# Altium schematic sheet CH340C UART USB.SchDoc
size A; SheetNumber: 6; SheetTotal: 6
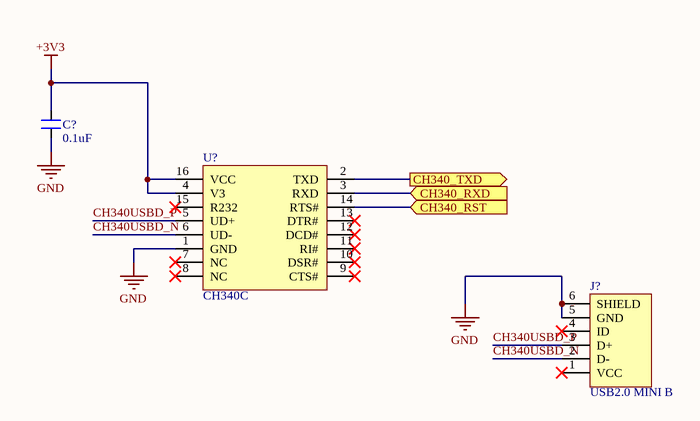
[diagram p0: CH340C UART USB.SchDoc]

## Parts
C?  0.1uF  [CAP_0805]
J?  USB2.0 MINI B  [CON_690-005-299-043]
U?  CH340C  [SOIC16_50_284_25X90_SMT]

## Ports
CH340_RST (in), CH340_RXD (in), CH340_TXD (out)

## Nets
+3V3: C?.1 U?.4(V3) U?.16(VCC)
GND: C?.2 J?.5(GND) J?.6(SHIELD) U?.1(GND)
CH340_RST: U?.14(RTS#) ; port CH340_RST
CH340_RXD: U?.3(RXD) ; port CH340_RXD
CH340_TXD: U?.2(TXD) ; port CH340_TXD
CH340USBD_N: J?.2(D-) U?.6(UD-)
CH340USBD_P: J?.3(D+) U?.5(UD+)

Not connected (* = marked no-connect by the designer): J? 1(VCC)* 4(ID)*; U? 7(NC)* 8(NC)* 9(CTS#)* 10(DSR#)* 11(RI#)* 12(DCD#)* 13(DTR#)* 15(R232)*

## Library data of the parts
C? = CAP_0.1uF-50V-5%-0805: 0.1µF ±5% 50V Ceramic Capacitor X7R 0805 (2012 Metric); Manufacturer: AVX Corporation; Manufacturer Part Number: 08055C104JAT4A; Alternate Part Number-1: 0805B104M500; Case/Package: 0805; Supplier-1: SIRICOM; Supplier Part Number-1: 0805B104J500CT
J? = CON_USB2.0-MINIB-SMD: USB - mini B USB 2.0 Receptacle Connector 5 Position Surface Mount, Right Angle; Manufacturer: EDAC; Manufacturer Part Number: 690-005-299-043; Alternate Part Number-1: NA; Case/Package: USB-MINI-B; Supplier-1: LCSC; Supplier Part Number-1: C105424
U? = IC_CH340C: USB Bridge, USB to UART USB 2.0 UART Interface; Manufacturer: Olimex; Alternate Part Number-1: NA; Manufacturer Part Number: CH340C; Case/Package: SOIC16; Supplier-1: LCSC; Supplier Part Number-1: C84681